# Altium schematic sheet [07] - USB-C Connector.SchDoc: USB-C Connector
size A3; Date: N.A.; ApprovedBy: N.A.; CheckedBy: N.A.; Author: N.A.; CompanyName: Johannes Berndorfer; DrawnBy: JBE; Organization: N.A.; Address1: Konrad Grefe Gasse 22; Address2: 1230 Wien; Address3: AUSTRIA; Address4: N.A.; DocumentNumber: 7; Revision: A; SheetNumber: 7; SheetTotal: 8; ProjectTitle: Berndo Keyboard Switchboard PCB; Reviewer: -; Time: N.A.; ImagePath: N.A.; Application_BuildNumber: N.A.
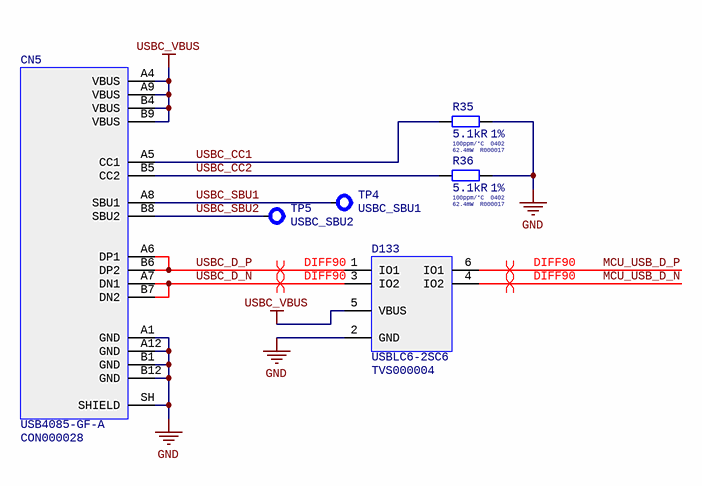
[diagram p0: [07] - USB-C Connector.SchDoc]

## Parts
CN5  USB4085-GF-A  Internal Part Number: CON000028  [CON-THT-USB-C-16POS-USB4085-GCT]
D133  USBLC6-2SC6  Internal Part Number: TVS000004  [SOT-23-6L-H1.45MM-ST]
R35  Case/Package: 0402  Resistance: 5.1kR  Temperature Coefficient: 100ppm/°C  Tolerance: 1%  Max Power Dissipation: 62.4mW  Internal Part Number: R000017  [RES-SMD-0402-0.4MM-IPC-MED]  (hidden comment: RC0402FR-075K1L)
R36  Case/Package: 0402  Resistance: 5.1kR  Temperature Coefficient: 100ppm/°C  Tolerance: 1%  Max Power Dissipation: 62.4mW  Internal Part Number: R000017  [RES-SMD-0402-0.4MM-IPC-MED]  (hidden comment: RC0402FR-075K1L)
TP4  USBC_SBU1  [TP-SMD-CIRCULAR-1MM]
TP5  USBC_SBU2  [TP-SMD-CIRCULAR-1MM]

## Nets
GND: CN5.A1(GND) CN5.A12(GND) CN5.B1(GND) CN5.B12(GND) CN5.SH(SHIELD) D133.2(GND) R35.2 R36.2
USBC_VBUS: CN5.A4(VBUS) CN5.A9(VBUS) CN5.B4(VBUS) CN5.B9(VBUS) D133.5(VBUS)
MCU_USB_D_N: D133.4(IO2)
MCU_USB_D_P: D133.6(IO1)
USBC_CC1: CN5.A5(CC1) R35.1
USBC_CC2: CN5.B5(CC2) R36.1
USBC_D_N: CN5.A7(DN1) CN5.B7(DN2) D133.3(IO2)
USBC_D_P: CN5.A6(DP1) CN5.B6(DP2) D133.1(IO1)
USBC_SBU1: CN5.A8(SBU1) TP4.1
USBC_SBU2: CN5.B8(SBU2) TP5.1

## Layout directives
differential pair; differential pair class DIFF90: MCU_USB_D_N, MCU_USB_D_P, USBC_D_N, USBC_D_P

## Notes on the sheet
- Title:
- Project:
- Document Nr.:
- Revision:
- Date:
- Drawn By:
- Time:
- Reviewed By:
- Sheet
- of
- Size:
- A3
- Variant:
- File:

## Library data of the parts
CN5 = USB4085-GF-A: CON USB TYPE C THROUGH HOLE 16POS; Manufacturer: Global Connector Technology; USB Standard: USB 2.0; Gender: Receptacle; Number of Positions: 16; Supplier 1: Digi-Key; Manufacturer Part Number: USB4085-GF-A; Stock 1: 0; RoHS: No; Contact Material: Copper Alloy; Contact Plating: Gold; Orientation: Right Angle; ComponentLink1URL: https://datasheet.ciiva.com/71788/2674755-71788146.pdf?src-supplier=Element14; ComponentLink1Description: https://datasheet.ciiva.com/71788/2674755-71788146.pdf?src-supplier=Element14; ComponentLink2URL: https://datasheet.ciiva.com/71788/usb4085-71788147.pdf?src-supplier=Digi-Key; ComponentLink2Description: https://datasheet.ciiva.com/71788/usb4085-71788147.pdf?src-supplier=Digi-Key; Supplier Part Number 1: 2073-USB4085-GF-ACT-ND
D133 = USBLC6-2SC6: TVS DIODE 2CH 5.25V 17V USB2.0 SOT23-6L; Manufacturer: STMicroelectronics; Data Rate: 480Mbps; Direction: Unidirectional,Bidirectional; Capacitance: 3.5pF; Operating Supply Voltage: 1.1V; Number of Elements: 1; Number of Channels: 2; Reverse Breakdown Voltage: 6V; Working Voltage: 5V; Power Line Protection: Yes; Test Current: 1mA; Max Reverse Leakage Current: 150nA; Peak Pulse Current: 5A; Element Configuration: Dual; Supplier 1: Digi-Key; Manufacturer Part Number: USBLC6-2SC6; Stock 1: 30680; Pricing 1: 1 = 0,47000, 10 = 0,39900, 100 = 0,29820, 500 = 0,23430, 1000 = 0,18105 (USD); RoHS: Yes; Mount: Surface Mount; Case/Package: SOT-23; Number of Pins: 6; Contact Plating: Tin,Matte; Min Operating Temperature: -40°C; Max Operating Temperature: 125°C; Packaging: Tape and Reel; Package Quantity: 3000; Polarity: Unidirectional,Bidirectional; Breakdown Voltage: 6V; Clamping Voltage: 17V; Termination: SMD/SMT; Number of Bidirectional Channels: 2; Reverse Standoff Voltage: 5.25V; Min Breakdown Voltage: 6V; ESD Protection: Yes; Max Breakdown Voltage: 6V; Leakage Current: 150nA; Length: 3.05mm; Height: 1.3mm; Width: 1.75mm; Depth: 1.75mm; Radiation Hardening: No; REACH SVHC: No SVHC; Lead Free: Lead Free; ComponentLink1URL: https://datasheet.ciiva.com/1268/1690354-1268384.pdf?src-supplier=Element14; ComponentLink1Description: https://datasheet.ciiva.com/1268/1690354-1268384.pdf?src-supplier=Element14; ComponentLink2URL: https://datasheet.ciiva.com/4508/cd00050750-113117-4508433.pdf?src-supplier=Mouser; ComponentLink2Description: https://datasheet.ciiva.com/4508/cd00050750-113117-4508433.pdf?src-supplier=Mouser; ComponentLink3URL: https://datasheet.ciiva.com/26787/usblc6-2sc6-26787908.pdf?src-supplier=IIIC; ComponentLink3Description: https://datasheet.ciiva.com/26787/usblc6-2sc6-26787908.pdf?src-supplier=IIIC; ComponentLink4URL: https://datasheet.ciiva.com/16200/cd00050750-16200026.pdf?src-supplier=Future+Electronics; ComponentLink4Description: https://datasheet.ciiva.com/16200/cd00050750-16200026.pdf?src-supplier=Future+Electronics; Supplier Part Number 1: 497-5235-1-ND
R35 R36 = RC0402FR-075K1L: RES 5K1 1% 1/16W SMD 0402 YAEGO; Manufacturer: Yageo; Power Rating: 63mW; Voltage Rating: 50V; Supplier 1: Digi-Key; Manufacturer Part Number: RC0402FR-075K1L; Stock 1: 3098997; Pricing 1: 1 = 0,10000, 10 = 0,01600, 100 = 0,00640, 1000 = 0,00289, 2500 = 0,00251, 5000 = 0,00207 (USD); RoHS: Yes; Case Code (Metric): 1005; Case Code (Imperial): 0402; Min Operating Temperature: -55°C; Max Operating Temperature: 155°C; Packaging: Tape and Reel; Package Quantity: 1; Composition: Thick Film; Number of Terminations: 2; Termination: SMD/SMT; Military Standard: Not; Voltage Rating (DC): 50V; Features: Moisture Resistant; Working Voltage: 50V; Length: 1mm; Height: 0.016inch; Width: 0.02inch; Depth: 0.5mm; REACH SVHC: Unknown; Lead Free: Lead Free; ComponentLink1URL: https://datasheet.ciiva.com/15189/getdatasheetpartid-323636-15189493.pdf?src-supplier=Verical; ComponentLink1Description: https://datasheet.ciiva.com/15189/getdatasheetpartid-323636-15189493.pdf?src-supplier=Verical; ComponentLink2URL: https://datasheet.ciiva.com/2453/pyu-r-int-thick-7-2453400.pdf?src-supplier=Digi-Key; ComponentLink2Description: https://datasheet.ciiva.com/2453/pyu-r-int-thick-7-2453400.pdf?src-supplier=Digi-Key; ComponentLink3URL: https://datasheet.ciiva.com/46394/1018594-46394936.pdf?src-supplier=Element14; ComponentLink3Description: https://datasheet.ciiva.com/46394/1018594-46394936.pdf?src-supplier=Element14; ComponentLink4URL: https://datasheet.ciiva.com/2453/pyu-r-int-thick-7-2453401.pdf?src-supplier=Digi-Key; ComponentLink4Description: https://datasheet.ciiva.com/2453/pyu-r-int-thick-7-2453401.pdf?src-supplier=Digi-Key; ComponentLink5URL: https://datasheet.ciiva.com/2453/pyu-r-int-thick-7-2453402.pdf?src-supplier=Digi-Key; ComponentLink5Description: https://datasheet.ciiva.com/2453/pyu-r-int-thick-7-2453402.pdf?src-supplier=Digi-Key; ComponentLink6URL: https://datasheet.ciiva.com/16744/pyu-rc0402-51-rohs-l-6-r-16744283.pdf?src-supplier=Future+Electronics; ComponentLink6Description: https://datasheet.ciiva.com/16744/pyu-rc0402-51-rohs-l-6-r-16744283.pdf?src-supplier=Future+Electronics; ComponentLink7URL: https://datasheet.ciiva.com/12558/pyu-rc0402-51-rohs-l-6-r-8721-12558460.pdf?src-supplier=Mouser; ComponentLink7Description: https://datasheet.ciiva.com/12558/pyu-rc0402-51-rohs-l-6-r-8721-12558460.pdf?src-supplier=Mouser; ComponentLink8URL: https://datasheet.ciiva.com/7983/1018594-7983519.pdf?src-supplier=Element14; ComponentLink8Description: https://datasheet.ciiva.com/7983/1018594-7983519.pdf?src-supplier=Element14; Supplier Part Number 1: 311-5.10KLRCT-ND
TP4 TP5 = TESTPOINT_CIRCULAR_1MM